# Altium project module_board.PrjPCB
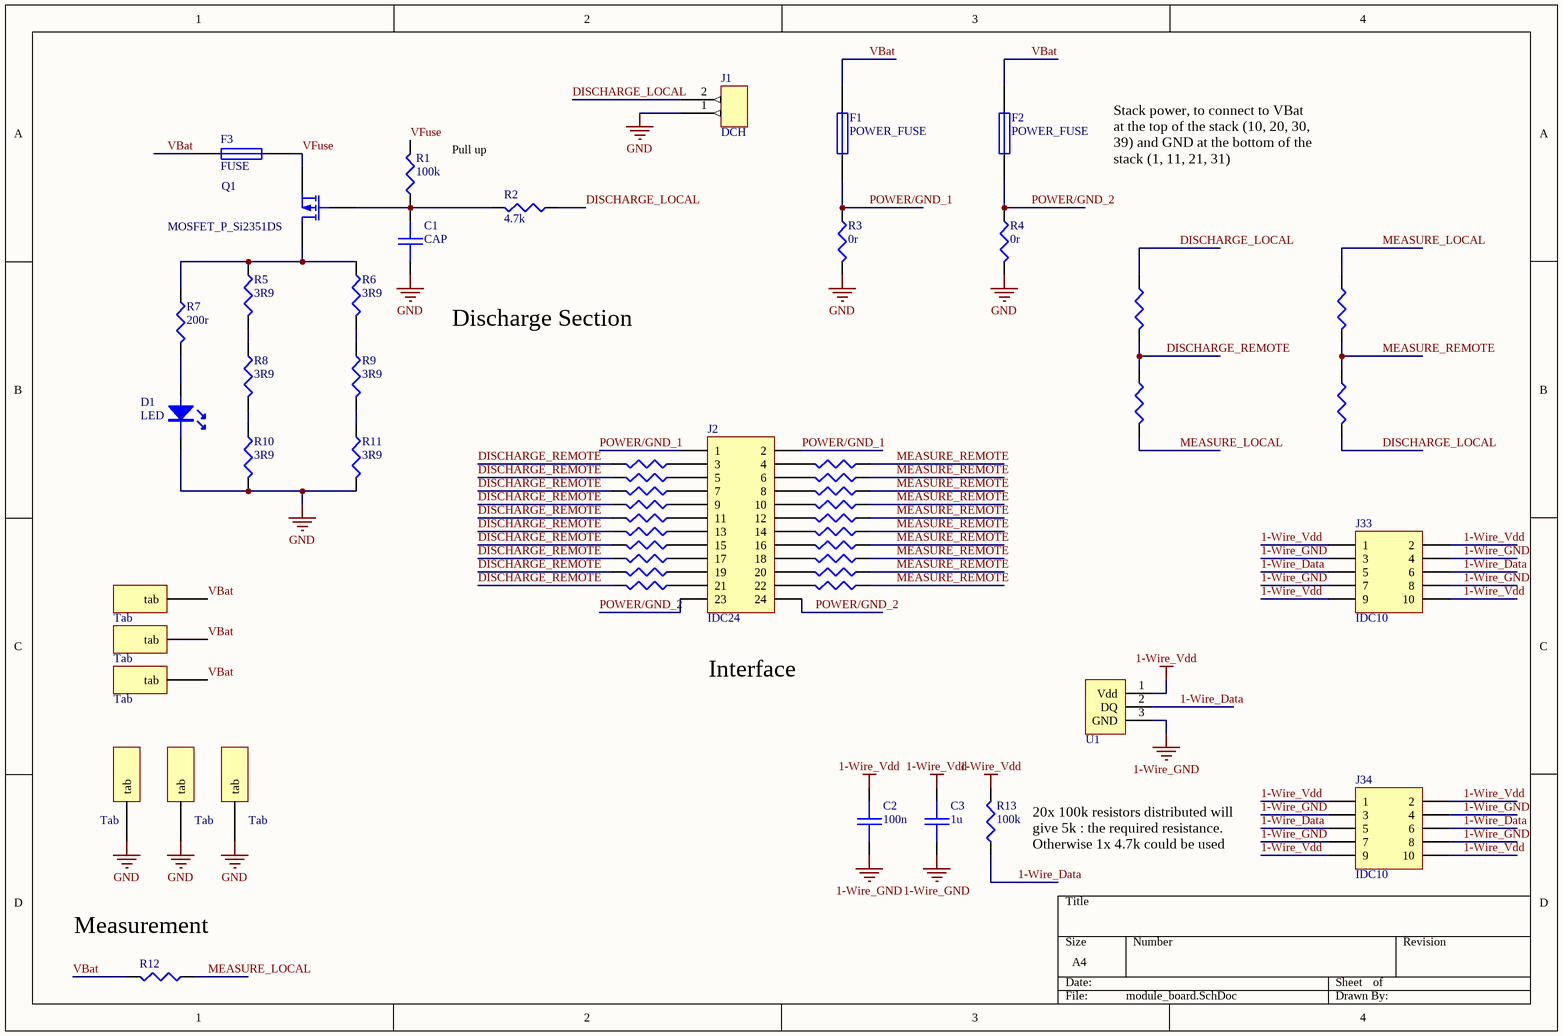
[diagram p0: module_board.SchDoc]
1 sheet, 56 parts. Net scope: global (net labels, ports and power ports of the same name join across sheets).
Board file: module_board.PcbDoc

## Sheet module_board.SchDoc
size A4

### Parts
C1  CAP  [0603]
C2  100n  [0603]
C3  1u  [0805]
D1  LED  [0805LED]
F1  POWER_FUSE  [LITTELFUSE-154]
F2  POWER_FUSE  [LITTELFUSE-154]
F3  FUSE  [LITTELFUSE-154]
J1  DCH  [IDC2]
J2  IDC24  [IDC24]
J11  Tab  [tab_connect]
J20  Tab  [tab_connect]
J27  Tab  [tab_connect]
J30  Tab  [tab_connect]
J31  Tab  [tab_connect]
J32  Tab  [tab_connect]
J33  IDC10  [IDC10]
J34  IDC10  [IDC10]
Q1  MOSFET_P_Si2351DS  [SOT23-3]
R1  100k  [0603]
R2  4.7k  [1206]
R3  Resistance: 0r  [1206]
R4  Resistance: 0r  [1206]
R5  3R9  [2512]
R6  3R9  [2512]
R7  200r  [0603]
R8  3R9  [2512]
R9  3R9  [2512]
R10  3R9  [2512]
R11  3R9  [2512]
R12  4.7k  [1206]  (value not drawn)
R13  100k  [0603]
R14  0k  [0603]  (value not drawn)
R15  0k  [0603]  (value not drawn)
R16  0k  [0603]  (value not drawn)
R17  0k  [0603]  (value not drawn)
R18  0k  [0603]  (value not drawn)
R19  0k  [0603]  (value not drawn)
R20  0k  [0603]  (value not drawn)
R21  0k  [0603]  (value not drawn)
R22  0k  [0603]  (value not drawn)
R23  0k  [0603]  (value not drawn)
R24  0k  [0603]  (value not drawn)
R25  0k  [0603]  (value not drawn)
R26  0k  [0603]  (value not drawn)
R27  0k  [0603]  (value not drawn)
R28  0k  [0603]  (value not drawn)
R29  0k  [0603]  (value not drawn)
R30  0k  [0603]  (value not drawn)
R31  0k  [0603]  (value not drawn)
R32  0k  [0603]  (value not drawn)
R33  0k  [0603]  (value not drawn)
R34  0k  [0603]  (value not drawn)
R35  0k  [0603]  (value not drawn)
R36  0k  [0603]  (value not drawn)
R37  0k  [0603]  (value not drawn)
U1  DS18B20  [TO-92]  (value not drawn)

### Nets
1-Wire_GND: C2.2 C3.2 J33.3 J33.4 J33.7 J33.8 J34.3 J34.4 J34.7 J34.8 U1.3(GND)
1-Wire_Vdd: C2.1 C3.1 J33.1 J33.2 J33.9 J33.10 J34.1 J34.2 J34.9 J34.10 R13.2 U1.1(Vdd)
GND: C1.2 D1.K J1.1 J30.0(tab) J31.0(tab) J32.0(tab) R3.2 R4.2 R10.2 R11.2
1-Wire_Data: J33.5 J33.6 J34.5 J34.6 R13.1 U1.2(DQ)
DISCHARGE_LOCAL: J1.2 R2.1 R34.1 R37.2
DISCHARGE_REMOTE: R14.2 R16.2 R18.2 R20.2 R22.2 R24.2 R26.2 R28.2 R30.2 R32.2 R34.2 R36.1
MEASURE_LOCAL: R12.1 R35.1 R36.2
MEASURE_REMOTE: R15.1 R17.1 R19.1 R21.1 R23.1 R25.1 R27.1 R29.1 R31.1 R33.1 R35.2 R37.1
POWER/GND_1: F1.1 J2.1 J2.2 R3.1
POWER/GND_2: F2.1 J2.23 J2.24 R4.1
VBat: F1.2 F2.2 F3.1 J11.0(tab) J20.0(tab) J27.0(tab) R12.2
VFuse: F3.2 Q1.2(S) R1.2
NetC1_1: C1.1 Q1.1(G) R1.1 R2.2
NetD1_A: D1.A R7.2
NetJ2_3: J2.3 R14.1
NetJ2_4: J2.4 R15.2
NetJ2_5: J2.5 R16.1
NetJ2_6: J2.6 R17.2
NetJ2_7: J2.7 R18.1
NetJ2_8: J2.8 R19.2
NetJ2_9: J2.9 R20.1
NetJ2_10: J2.10 R21.2
NetJ2_11: J2.11 R22.1
NetJ2_12: J2.12 R23.2
NetJ2_13: J2.13 R24.1
NetJ2_14: J2.14 R25.2
NetJ2_15: J2.15 R26.1
NetJ2_16: J2.16 R27.2
NetJ2_17: J2.17 R28.1
NetJ2_18: J2.18 R29.2
NetJ2_19: J2.19 R30.1
NetJ2_20: J2.20 R31.2
NetJ2_21: J2.21 R32.1
NetJ2_22: J2.22 R33.2
NetQ1_3: Q1.3(D) R5.1 R6.1 R7.1
NetR5_2: R5.2 R8.1
NetR6_2: R6.2 R9.1
NetR8_2: R8.2 R10.1
NetR9_2: R9.2 R11.1

### Notes on the sheet
- Pull up
- Stack power, to connect to VBat at the top of the stack (10, 20, 30, 39) and GND at the bottom of the stack (1, 11, 21, 31)
- Discharge Section
- Interface
- (near R13) 20x 100k resistors distributed will give 5k : the required resistance. Otherwise 1x 4.7k could be used
- (near R12) Measurement

### Library data of the parts
C1 = CAP: Capacitor; Value: 100nF
C2 C3 = CAP: Capacitor
F1 F2 = FUSE
J1 = CON2
J2 = IDC24: Connector
J11 J20 J27 J30-J32 = tab_connection
J33 J34 = IDC10: Connector
Q1 = MOSFET_P_Si2351DS: Si2351DS P-Channel MOSFET; Published: 8-Jun-2000; LatestRevisionDate: 17-Jul-2002; LatestRevisionNote: Re-released for DXP Platform.; PackageVersion: 1995/1996; PackageReference: E3; Publisher: Altium Limited; PackageDescription: TO, Flat Index; 3 In-Line, Axial Leads; Body Dia. 4.6mm; Lead Dia. 0.5 mm (max)
R1-R4 R12 R13 = RES1: Resistor
  R1: Resistance: 100k
  R2 R12: Resistance: 4.7k
R5 R6 R8-R11 = RES1: Resistor; Value: 3R0
R7 = RES1: Resistor; Value: 200
R14-R37 = RES1: Resistor; Resistance: 100k
U1 = DS18B20: DS18B20 1-Wire Temperature sensor